# Altium schematic sheet Root.SchDoc
size A4; SheetNumber: 4; SheetTotal: 5
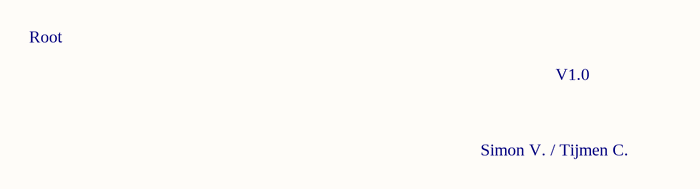
[diagram p0: Root.SchDoc]

## Notes on the sheet
- Root
- V1.0
- Simon V. / Tijmen C.